# Altium schematic sheet Ethernet.SchDoc
size B; SheetNumber: 5; SheetTotal: 5
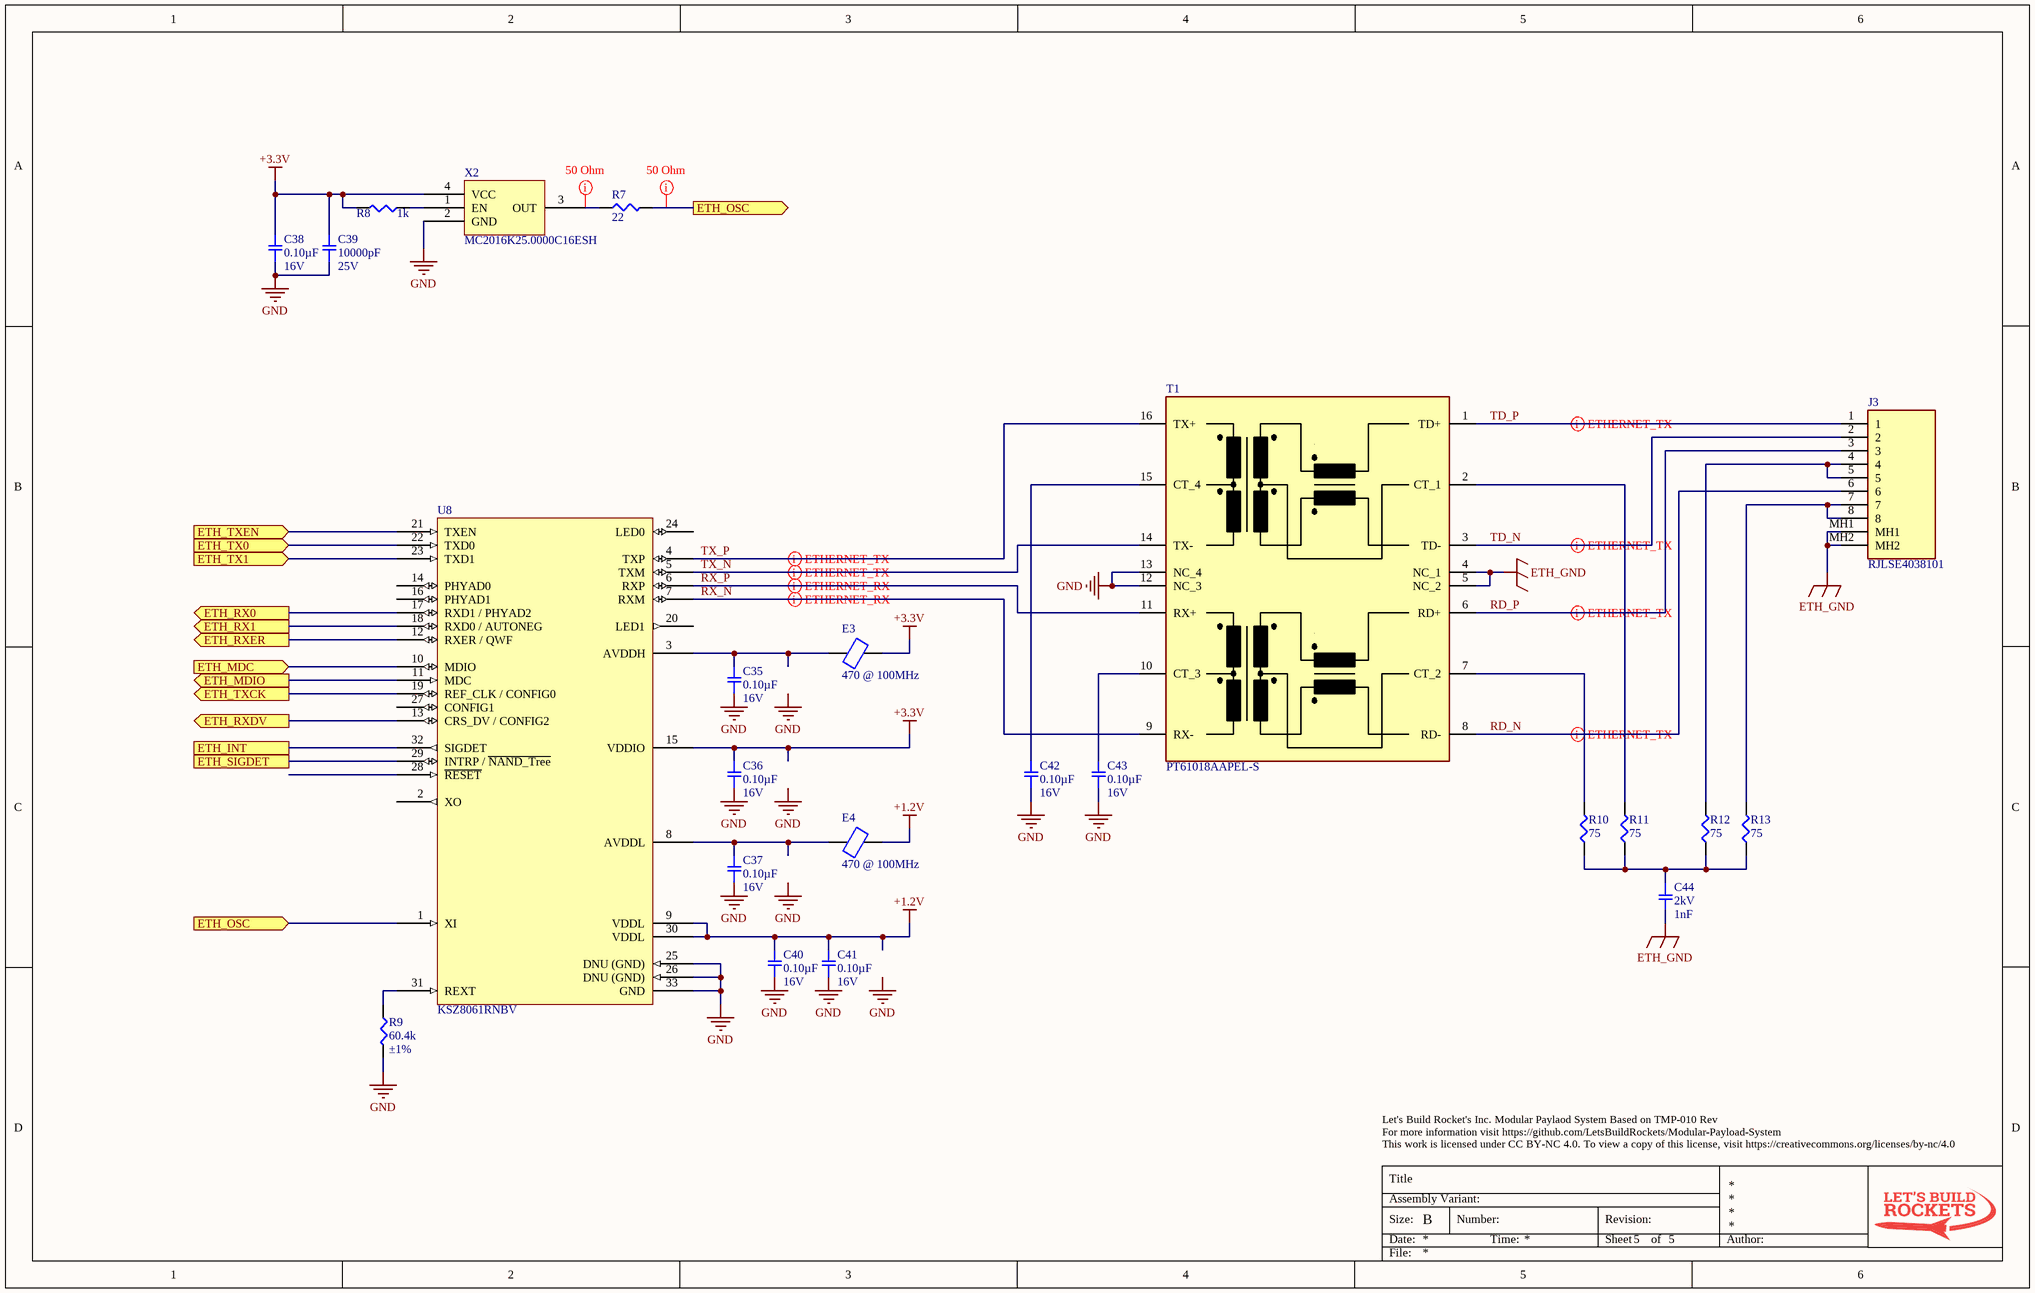
[diagram p0: Ethernet.SchDoc]

## Parts
C35  0.10µF  Voltage: 16V  [SMD-0402C]
C36  0.10µF  Voltage: 16V  [SMD-0402C]
C37  0.10µF  Voltage: 16V  [SMD-0402C]
C38  0.10µF  Voltage: 16V  [SMD-0402C]
C39  10000pF  Voltage: 25V  [SMD-0402C]
C40  0.10µF  Voltage: 16V  [SMD-0402C]
C41  0.10µF  Voltage: 16V  [SMD-0402C]
C42  0.10µF  Voltage: 16V  [SMD-0402C]
C43  0.10µF  Voltage: 16V  [SMD-0402C]
C44  value 1nF  Voltage: 2kV  [SMD-1206C]  (hidden comment: C1206C102KGRACAUTO)
E3  value 470 @ 100MHz  (hidden comment: MPZ1608S471ATD25)
E4  value 470 @ 100MHz  (hidden comment: MPZ1608S471ATD25)
J3  RJLSE4038101  [RJLSE4038101]
R7  22  [SMD-0402-RES]
R8  1k  [SMD-0402-RES]
R9  60.4k  Tolerance: ±1%  [SMD-0402-RES]
R10  75  [SMD-0402-RES]
R11  75  [SMD-0402-RES]
R12  75  [SMD-0402-RES]
R13  75  [SMD-0402-RES]
T1  PT61018AAPEL-S  [SOIC127P930X590-16N]
U8  KSZ8061RNBV
X2  MC2016K25.0000C16ESH  [MC2016]

## Ports
ETH_INT, ETH_MDC (in), ETH_MDIO (out), ETH_OSC (in), ETH_OSC (out), ETH_RX0 (out), ETH_RX1 (out), ETH_RXDV (out), ETH_RXER (out), ETH_SIGDET, ETH_TX0 (in), ETH_TX1 (in), ETH_TXCK (out), ETH_TXEN (in)

## Nets
+1.2V: C40.2 C41.2 E4.2 U8.9(VDDL) U8.30(VDDL)
+3.3V: C36.2 C38.2 C39.2 E3.2 R8.2 U8.15(VDDIO) X2.4(VCC)
ETH_GND: C44.2 J3.MH1 J3.MH2 T1.4(NC_1) T1.5(NC_2)
GND: C35.1 C36.1 C37.1 C38.1 C39.1 C40.1 C41.1 C42.1 C43.1 R9.2 T1.12(NC_3) T1.13(NC_4) U8.25(DNU_(GND)) U8.26(DNU_(GND)) U8.33(GND) X2.2(GND)
ETH_INT: U8.32(SIGDET) ; port ETH_INT
ETH_MDC: U8.10(MDIO) ; port ETH_MDC
ETH_MDIO: U8.11(MDC) ; port ETH_MDIO
ETH_OSC: R7.2 U8.1(XI) ; port ETH_OSC
ETH_RX0: U8.17(RXD1_/_PHYAD2) ; port ETH_RX0
ETH_RX1: U8.18(RXD0_/_AUTONEG) ; port ETH_RX1
ETH_RXDV: U8.13(CRS_DV_/_CONFIG2) ; port ETH_RXDV
ETH_RXER: U8.12(RXER_/_QWF) ; port ETH_RXER
ETH_SIGDET: U8.29(INTRP_/_~{NAND_Tree}) ; port ETH_SIGDET
ETH_TX0: U8.22(TXD0) ; port ETH_TX0
ETH_TX1: U8.23(TXD1) ; port ETH_TX1
ETH_TXCK: U8.19(REF_CLK_/_CONFIG0) ; port ETH_TXCK
ETH_TXEN: U8.21(TXEN) ; port ETH_TXEN
RD_N: J3.6 T1.8(RD-)
RD_P: J3.3 T1.6(RD+)
RX_N: T1.9(RX-) U8.7(RXM)
RX_P: T1.11(RX+) U8.6(RXP)
TD_N: J3.2 T1.3(TD-)
TD_P: J3.1 T1.1(TD+)
TX_N: T1.14(TX-) U8.5(TXM)
TX_P: T1.16(TX+) U8.4(TXP)
NetC35_2: C35.2 E3.1 U8.3(AVDDH)
NetC37_2: C37.2 E4.1 U8.8(AVDDL)
NetC42_2: C42.2 T1.15(CT_4)
NetC43_2: C43.2 T1.10(CT_3)
NetC44_1: C44.1 R10.1 R11.1 R12.1 R13.1
NetJ3_4: J3.4 J3.5 R12.2
NetJ3_7: J3.7 J3.8 R13.2
NetR7_1: R7.1 X2.3(OUT)
NetR8_1: R8.1 X2.1(EN)
NetR9_1: R9.1 U8.31(REXT)
NetR10_2: R10.2 T1.7(CT_2)
NetR11_2: R11.2 T1.2(CT_1)

Not connected (* = marked no-connect by the designer): U8 2(XO) 14(PHYAD0) 16(PHYAD1) 20(LED1) 24(LED0) 27(CONFIG1) 28(~{RESET})

## Layout directives
differential pair: RD_N, RD_P, RX_N, RX_P, TD_N, TD_P, TX_N, TX_P
rule Width Constraint [Pref Impedance = 50.00ohms    Min Impedance = 50.00ohms    Max Impedance = 50.00ohms]: ETH_OSC, NetR7_1

## Notes on the sheet
- Labels drawn without touching a wire or pin: GND
- Let's Build Rocket's Inc. Modular Paylaod System Based on TMP-010 Rev
  For more information visit https://github.com/LetsBuildRockets/Modular-Payload-System
  This work is licensed under CC BY-NC 4.0. To view a copy of this license, visit https://creativecommons.org/licenses/by-nc/4.0
- Title
- Size:
- Date:
- Assembly Variant:
- B
- Number:
- Time:
- Revision:
- Sheet
- of
- Author:
- File:

## Library data of the parts
C35-C38 C40-C43 = GCM155R71C104KA55D: CAP CER 0.1UF 16V X7R 0402; Manufacturer: Murata Electronics North America; Factory Stock: 0; Unit Price (USD): 0.1; Minimum Quantity: 1; Tolerance: ±10%; Datasheets: http://www.murata.com/~/media/webrenewal/support/library/catalog/products/capacitor/mlcc/c03e.ashx; Image: //media.digikey.com/Renders/Murata%20Renders/ZRB-SERIES-0402.jpg; Digi-Key Part Number: 490-4759-1-ND; Part Number: GCM155R71C104KA55D; Quantity Available: 734194; @ qty: 0; Packaging: Cut Tape (CT); Series: GCM; Part Status: Active; Value: 0.10µF; Temperature Coefficient: X7R; Operating Temperature: -55°C ~ 125°C; Features: -; Ratings: AEC-Q200; Applications: Automotive; Mounting Type: Surface Mount, MLCC; Package / Case: 0402 (1005 Metric); Size / Dimension: 0.039" L x 0.020" W (1.00mm x 0.50mm); Height - Seated (Max): -; Thickness (Max): 0.022" (0.55mm); Lead Spacing: -; Lead Style: -
C39 = GCM155R71E103KA37D: CAP CER 10000PF 25V X7R 0402; Manufacturer: Murata Electronics North America; Factory Stock: 0; Unit Price (USD): 0.1; Minimum Quantity: 1; Tolerance: ±10%; Datasheets: http://www.murata.com/~/media/webrenewal/support/library/catalog/products/capacitor/mlcc/c03e.ashx; Image: //media.digikey.com/Renders/Murata%20Renders/ZRB-SERIES-0402.jpg; Digi-Key Part Number: 490-6043-1-ND; Part Number: GCM155R71E103KA37D; Quantity Available: 128782; @ qty: 0; Packaging: Cut Tape (CT); Series: GCM; Part Status: Active; Value: 10000pF; Temperature Coefficient: X7R; Operating Temperature: -55°C ~ 125°C; Features: -; Ratings: AEC-Q200; Applications: Automotive; Mounting Type: Surface Mount, MLCC; Package / Case: 0402 (1005 Metric); Size / Dimension: 0.039" L x 0.020" W (1.00mm x 0.50mm); Height - Seated (Max): -; Thickness (Max): 0.022" (0.55mm); Lead Spacing: -; Lead Style: -
C44 = C1206C102KGRACAUTO: Unit Price (USD): 0.26
E3 E4 = MPZ1608S471ATD25: DCR: 150mohm; Imax: 1A; Unit Price (USD): 0.10
J3 = RJLSE4038101: Connector; Manufacturer_Name: Amphenol; Unit Price (USD): 1.35; Datasheet Link: https://componentsearchengine.com//RJLSE4038101.pdf; Height: 11.85mm; Mouser2 Part Number: 523-RJLSE4038101; Mouser2 Price/Stock: https://www.mouser.com/Search/Refine.aspx?Keyword=523-RJLSE4038101; Manufacturer_Part_Number: RJLSE4038101
R7 = ERJ-2RKF22R0X: RES SMD 22 OHM 1% 1/10W 0402; Manufacturer: Panasonic Electronic Components; Factory Stock: 0; Unit Price (USD): 0.00496; @ qty: 1500; Minimum Quantity: 1; Power (Watts): 0.1W, 1/10W; Temperature Coefficient: ±100ppm/°C; Part Number: ERJ-2RKF22R0X; Datasheets: http://industrial.panasonic.com/www-cgi/jvcr13pz.cgi?E+PZ+3+AOA0002+ERJ2RKF22R0X+7+WW; Image: //media.digikey.com/Photos/Panasonic%20Photos/ERJ-PA2-Series.jpg; Digi-Key Part Number: P22.0LCT-ND; Quantity Available: 620432; Packaging: Cut Tape (CT); Series: ERJ; Part Status: Active; Value: 22; Tolerance: ±1%; Composition: Thick Film; Features: Automotive AEC-Q200; Operating Temperature: -55°C ~ 155°C; Package / Case: 0402 (1005 Metric); Supplier Device Package: 0402; Size / Dimension: 0.039" L x 0.020" W (1.00mm x 0.50mm); Height - Seated (Max): 0.016" (0.40mm); Number of Terminations: 2; Failure Rate: -
R8 = ERJ-2GEJ102X: RES SMD 1K OHM 5% 1/10W 0402; Manufacturer: Panasonic Electronic Components; Factory Stock: 0; Unit Price (USD): 0.00350; @ qty: 1500; Minimum Quantity: 1; Power (Watts): 0.1W, 1/10W; Temperature Coefficient: ±200ppm/°C; Part Number: ERJ-2GEJ102X; Datasheets: http://industrial.panasonic.com/www-cgi/jvcr13pz.cgi?E+PZ+3+AOA0001+ERJ2GEJ102X+7+WW; Image: //media.digikey.com/Photos/Panasonic%20Photos/ERJ-PA2-Series.jpg; Digi-Key Part Number: P1.0KJCT-ND; Quantity Available: 1939857; Packaging: Cut Tape (CT); Series: ERJ; Part Status: Active; Value: 1k; Tolerance: ±5%; Composition: Thick Film; Features: Automotive AEC-Q200; Operating Temperature: -55°C ~ 155°C; Package / Case: 0402 (1005 Metric); Supplier Device Package: 0402; Size / Dimension: 0.039" L x 0.020" W (1.00mm x 0.50mm); Height - Seated (Max): 0.016" (0.40mm); Number of Terminations: 2; Failure Rate: -
R9 = ERJ-2RKF6042X: RES SMD 60.4K OHM 1% 1/10W 0402; Manufacturer: Panasonic Electronic Components; Factory Stock: 0; Unit Price (USD): 0.00496; @ qty: 1500; Minimum Quantity: 1; Power (Watts): 0.1W, 1/10W; Temperature Coefficient: ±100ppm/°C; Part Number: ERJ-2RKF6042X; Datasheets: http://industrial.panasonic.com/www-cgi/jvcr13pz.cgi?E+PZ+3+AOA0002+ERJ2RKF6042X+7+WW; Image: //media.digikey.com/Photos/Panasonic%20Photos/ERJ-PA2-Series.jpg; Digi-Key Part Number: P60.4KLCT-ND; Quantity Available: 237593; Packaging: Cut Tape (CT); Series: ERJ; Part Status: Active; Value: 60.4k; Composition: Thick Film; Features: Automotive AEC-Q200; Operating Temperature: -55°C ~ 155°C; Package / Case: 0402 (1005 Metric); Supplier Device Package: 0402; Size / Dimension: 0.039" L x 0.020" W (1.00mm x 0.50mm); Height - Seated (Max): 0.016" (0.40mm); Number of Terminations: 2; Failure Rate: -
R10-R13 = ERJ-2GEJ750X: RES SMD 75 OHM 5% 1/10W 0402; Manufacturer: Panasonic Electronic Components; Factory Stock: 0; Unit Price (USD): 0.00350; @ qty: 1500; Minimum Quantity: 1; Power (Watts): 0.1W, 1/10W; Temperature Coefficient: ±200ppm/°C; Part Number: ERJ-2GEJ750X; Datasheets: http://industrial.panasonic.com/www-cgi/jvcr13pz.cgi?E+PZ+3+AOA0001+ERJ2GEJ750X+7+WW; Image: //media.digikey.com/Photos/Panasonic%20Photos/ERJ-PA2-Series.jpg; Digi-Key Part Number: P75JCT-ND; Quantity Available: 120738; Packaging: Cut Tape (CT); Series: ERJ; Part Status: Active; Value: 75; Tolerance: ±5%; Composition: Thick Film; Features: Automotive AEC-Q200; Operating Temperature: -55°C ~ 155°C; Package / Case: 0402 (1005 Metric); Supplier Device Package: 0402; Size / Dimension: 0.039" L x 0.020" W (1.00mm x 0.50mm); Height - Seated (Max): 0.016" (0.40mm); Number of Terminations: 2; Failure Rate: -
T1 = PT61018AAPEL-S: Transformer; Manufacturer_Name: Bourns; Unit Price (USD): 4.63; Datasheet Link: http://www.bourns.com/docs/Product-Datasheets/pt61018aapel-s.pdf?sfvrsn=2; Height: 5.9mm; Manufacturer_Part_Number: PT61018AAPEL-S
U8 = KSZ8061RNBV: Unit Price (USD): 2.17
X2 = MC2016K25.0000C16ESH: Unit Price (USD): 2.15